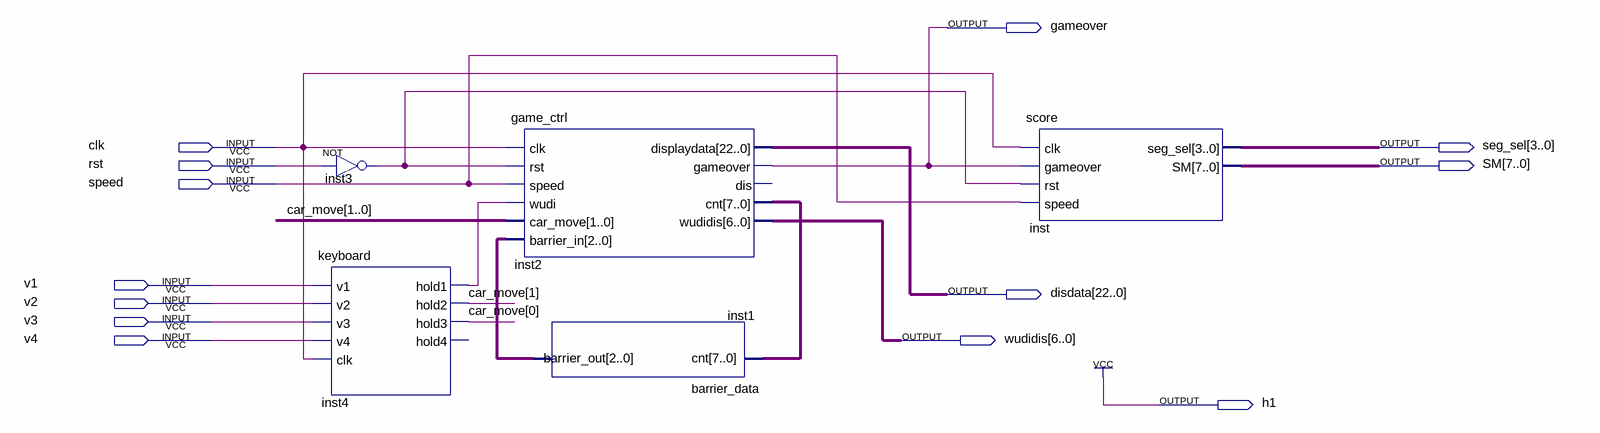
[diagram p0: schematic sheet]
// Quartus schematic game.bdf as structural Verilog: 5 symbols, 13 pins
module game (
  input  clk,
  input  rst,
  input  speed,
  input  v1,
  input  v2,
  input  v3,
  input  v4,
  output gameover,
  output [3:0] seg_sel,
  output [7:0] SM,
  output [22:0] disdata,
  output [6:0] wudidis,
  output h1
);

  wire inst3_out, inst4_hold1;
  wire [1:0] car_move;
  wire [2:0] inst1_barrier_out;
  wire [7:0] inst2_cnt;

  not inst3 (inst3_out, rst);
  keyboard inst4 (
    .v1(v1), .v2(v2), .v3(v3), .v4(v4), .clk(clk), .hold1(inst4_hold1), .hold2(car_move[1]),
    .hold3(car_move[0]));  // open: hold4
  game_ctrl inst2 (
    .clk(clk), .rst(inst3_out), .speed(speed), .wudi(inst4_hold1), .car_move(car_move),
    .barrier_in(inst1_barrier_out), .displaydata(disdata), .gameover(gameover), .cnt(inst2_cnt),
    .wudidis(wudidis));  // open: dis
  barrier_data inst1 (.cnt(inst2_cnt), .barrier_out(inst1_barrier_out));
  score inst (.clk(clk), .gameover(gameover), .rst(inst3_out), .speed(speed), .seg_sel(seg_sel), .SM(SM));

  assign h1 = 1'b1;
endmodule
